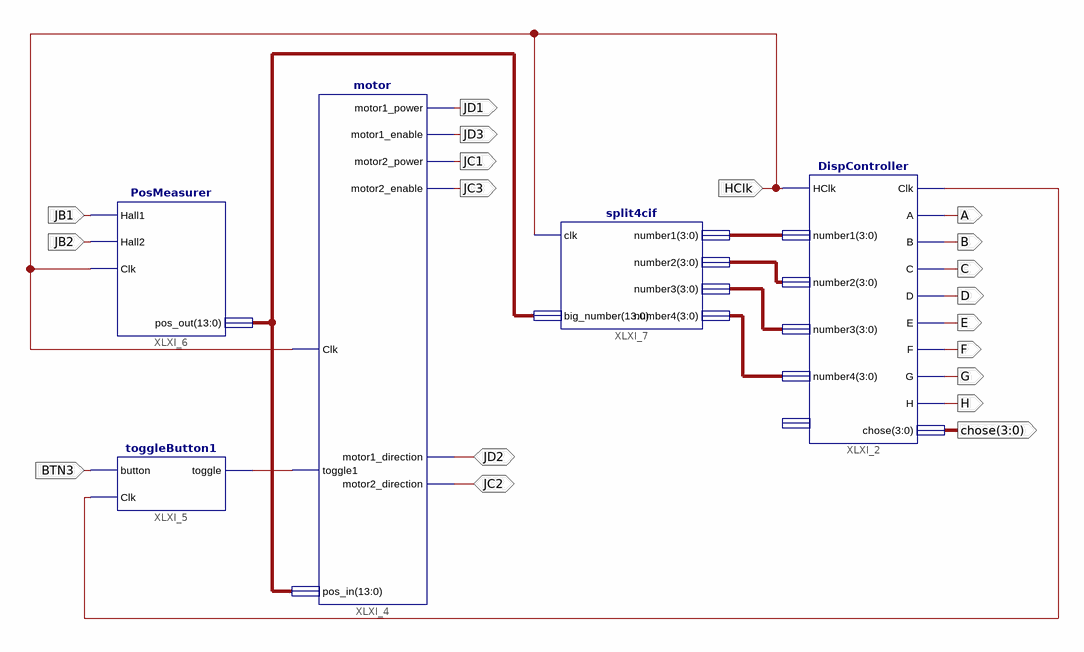
[diagram p0: schematic sheet 1]
// Xilinx ISE schematic motor_control.sch (spartan3e) as structural Verilog: 5 symbols, 19 ports
module motor_control (
  input  JB1,
  input  JB2,
  input  BTN3,
  input  HClk,
  inout  JD2,
  inout  JC2,
  output JC3,
  output JC1,
  output JD3,
  output JD1,
  output A,
  output B,
  output C,
  output D,
  output E,
  output F,
  output G,
  output H,
  output [3:0] chose
);

  wire XLXN_71, XLXN_90;
  wire [3:0] XLXN_5, XLXN_6, XLXN_7, XLXN_8;
  wire [13:0] XLXN_87;

  DispController XLXI_2 (
    .HClk(HClk), .number1(XLXN_5), .number2(XLXN_6), .number3(XLXN_7), .number4(XLXN_8), .Clk(XLXN_90),
    .A(A), .B(B), .C(C), .D(D), .E(E), .F(F), .G(G), .H(H), .chose(chose));  // open: dot
  motor XLXI_4 (
    .Clk(HClk), .toggle1(XLXN_71),
    .pos_in({XLXN_87[0], XLXN_87[1], XLXN_87[2], XLXN_87[3], XLXN_87[4], XLXN_87[5], XLXN_87[6], XLXN_87[7], XLXN_87[8], XLXN_87[9], XLXN_87[10], XLXN_87[11], XLXN_87[12], XLXN_87[13]}),
    .motor1_direction(JD2), .motor2_direction(JC2), .motor1_power(JD1), .motor1_enable(JD3),
    .motor2_power(JC1), .motor2_enable(JC3));
  toggleButton1 XLXI_5 (.button(BTN3), .Clk(XLXN_90), .toggle(XLXN_71));
  PosMeasurer XLXI_6 (
    .Hall1(JB1), .Hall2(JB2), .Clk(HClk),
    .pos_out({XLXN_87[0], XLXN_87[1], XLXN_87[2], XLXN_87[3], XLXN_87[4], XLXN_87[5], XLXN_87[6], XLXN_87[7], XLXN_87[8], XLXN_87[9], XLXN_87[10], XLXN_87[11], XLXN_87[12], XLXN_87[13]}));
  split4cif XLXI_7 (
    .clk(HClk),
    .big_number({XLXN_87[0], XLXN_87[1], XLXN_87[2], XLXN_87[3], XLXN_87[4], XLXN_87[5], XLXN_87[6], XLXN_87[7], XLXN_87[8], XLXN_87[9], XLXN_87[10], XLXN_87[11], XLXN_87[12], XLXN_87[13]}),
    .number1(XLXN_5), .number2(XLXN_6), .number3(XLXN_7), .number4(XLXN_8));
endmodule
